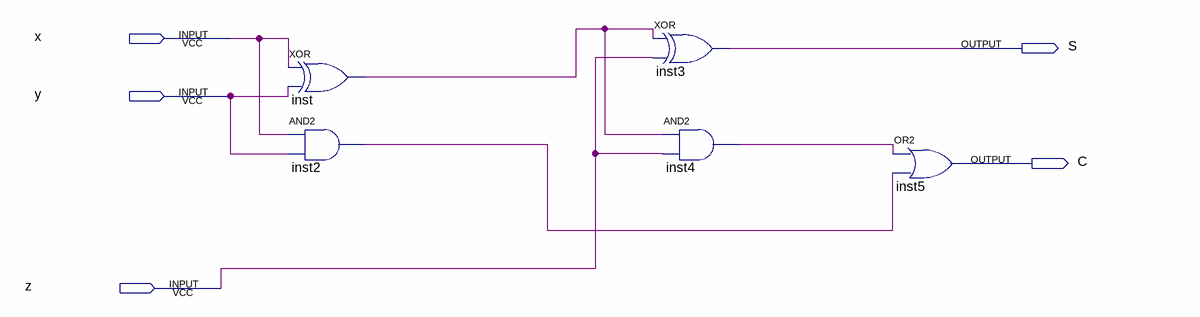
[diagram p0: schematic sheet]
// Quartus schematic fulladder1.bdf as structural Verilog: 5 symbols, 5 pins
module fulladder1 (
  input  x,
  input  y,
  input  z,
  output S,
  output C
);

  wire inst2_out, inst4_out, inst_out;

  xor inst (inst_out, x, y);
  and inst2 (inst2_out, x, y);
  xor inst3 (S, inst_out, z);
  and inst4 (inst4_out, inst_out, z);
  or inst5 (C, inst4_out, inst2_out);
endmodule
